# Altium schematic sheet CANBUS_Pendant.SchDoc: RP2040 CNC
size B; Author: AM; CompanyName: Expatria Technologies; DrawnBy: A.Marles; Engineer: AM; Organization: Expatria Technolgoies; Address1: PO Box 2084; Address3: Merritt, BC V1K 1B8; Address4: Canada; DocumentNumber: 24; SheetNumber: 24; SheetTotal: 27
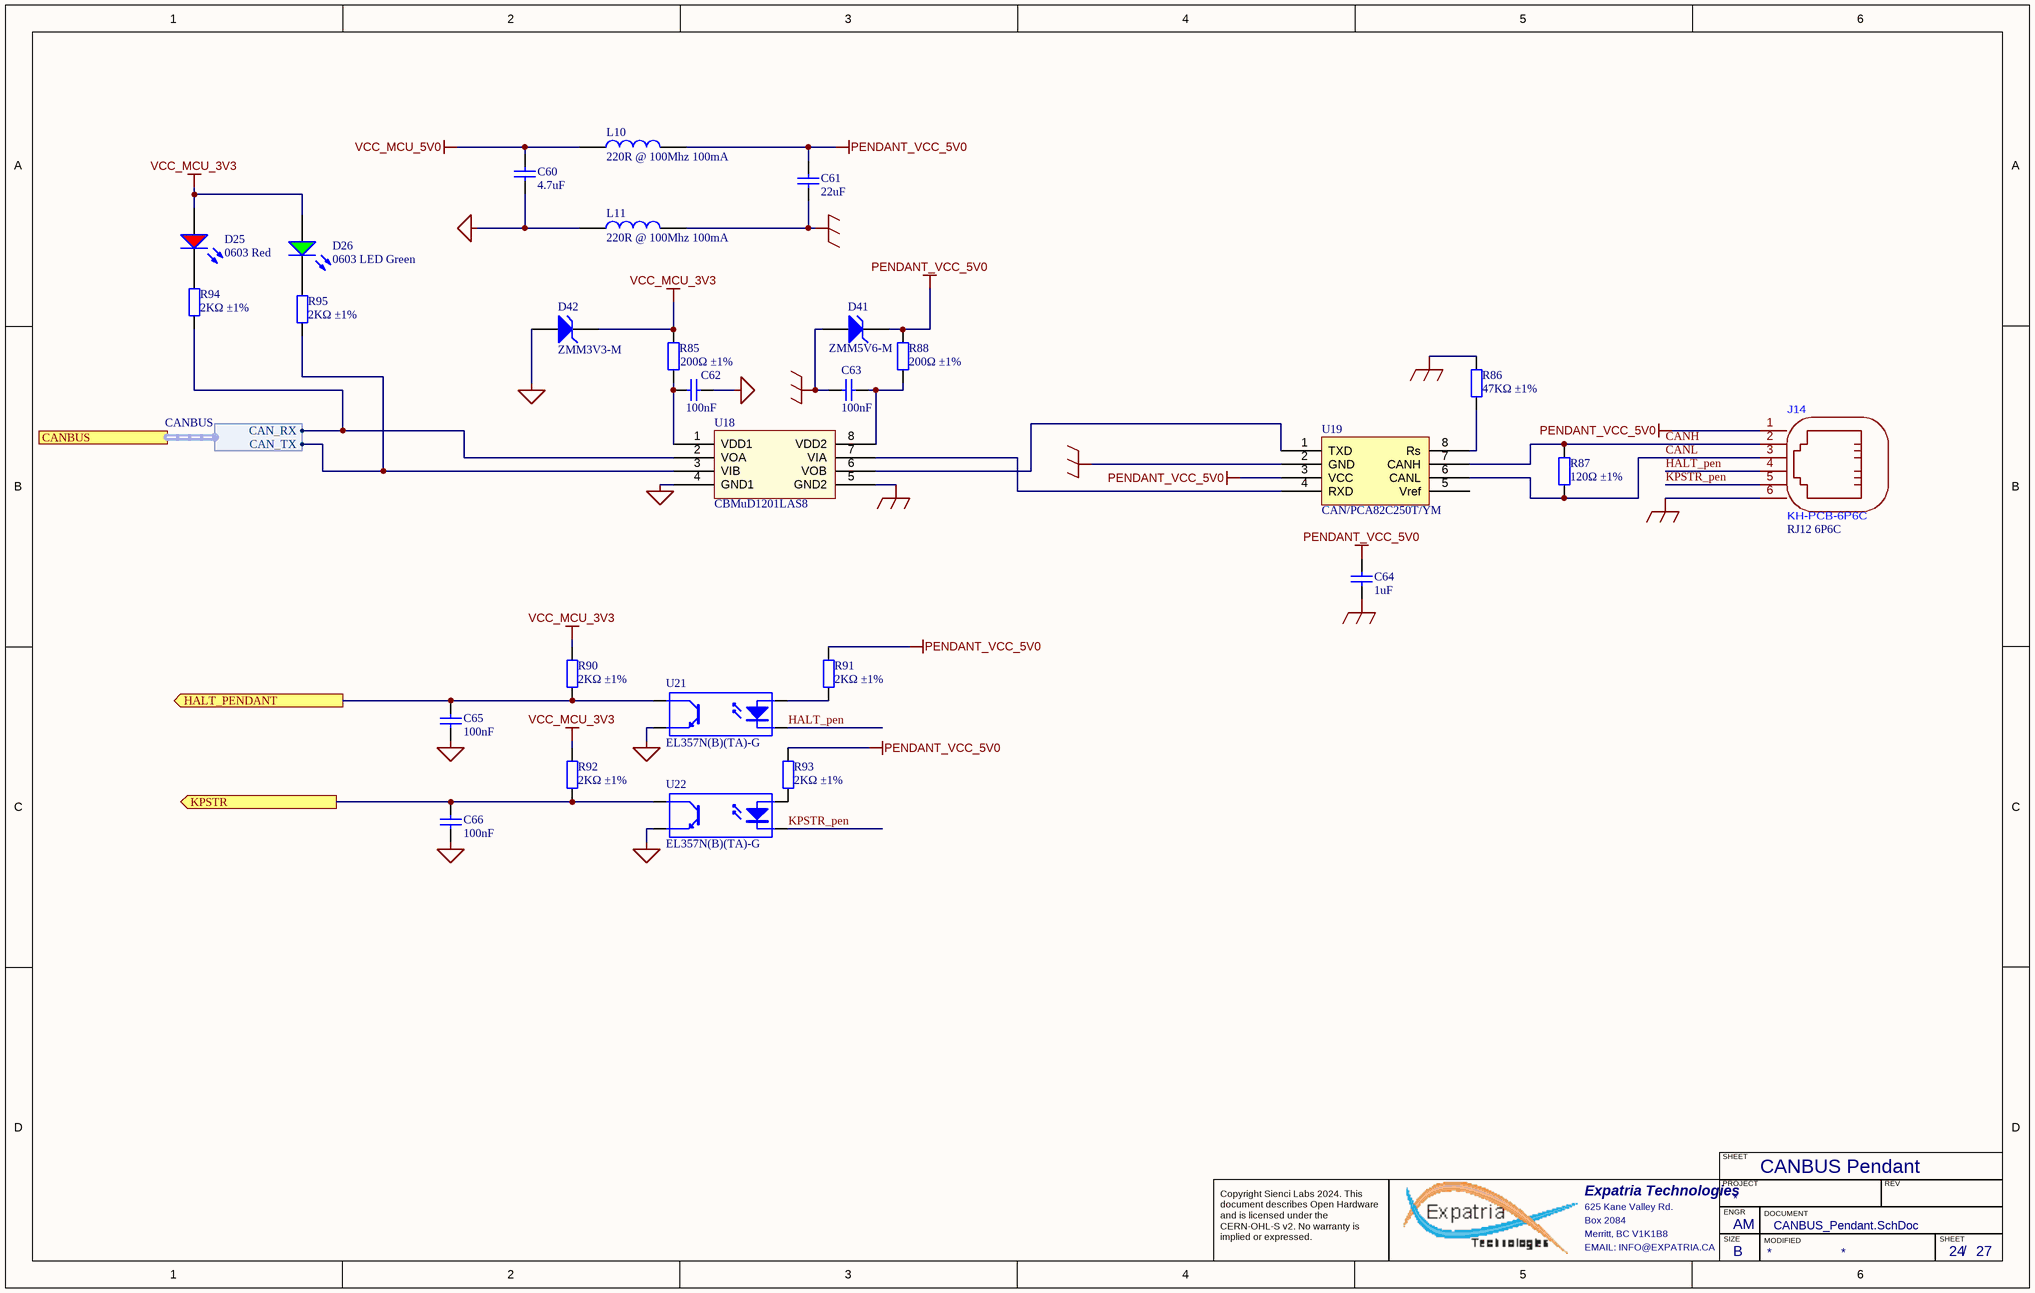
[diagram p0: CANBUS_Pendant.SchDoc]

## Parts
C60  4.7uF  [0805_C]
C61  22uF  [0805_C]
C62  100nF  [0402_C]
C63  100nF  [0402_C]
C64  1uF  [0603_C]
C65  100nF  [0603_C]
C66  100nF  [0603_C]
D25  0603 Red  [0603_LED_S1]
D26  0603 LED Green  [0603_LED_S1 - GREEN]
D41  ZMM5V6-M  [LL-34]
D42  ZMM3V3-M  [LL-34]
J14  KH-PCB-6P6C  value RJ12 6P6C  [RJ11-TH_DS1133-S60BPX]
L10  220R @ 100Mhz 100mA  [0402_L]
L11  220R @ 100Mhz 100mA  [0402_L]
R85  200Ω ±1%  [0402_R]
R86  47KΩ ±1%  [0402_R]
R87  120Ω ±1%  [0805_R]
R88  200Ω ±1%  [0402_R]
R90  2KΩ ±1%  [0402_R]
R91  2KΩ ±1%  [0402_R]
R92  2KΩ ±1%  [0402_R]
R93  2KΩ ±1%  [0402_R]
R94  2KΩ ±1%  [0402_R]
R95  2KΩ ±1%  [0402_R]
U18  CBMuD1201LAS8  [SOIC-8_150mil]
U19  CAN/PCA82C250T/YM  [SOIC-8_150mil]
U21  EL357N(B)(TA)-G  [SOP-4_P2.54]
U22  EL357N(B)(TA)-G  [SOP-4_P2.54]

## Ports
CANBUS (harness CANBUS), HALT_PENDANT (out), KPSTR (out)

## Harnesses
CANBUS: CAN_TX, CAN_RX

## Nets
MCU_GND: C60.1 C62.2 C65.1 C66.1 D42.1(A) L11.1 U18.4(GND1) U21.3(E) U22.3(E)
PEND_GND: C61.1 C63.1 C64.1 D41.1(A) J14.6(NC) L11.2 R86.2 U18.5(GND2) U19.2(GND)
PENDANT_VCC_5V0: C61.2 C64.2 D41.2(K) J14.1(MCLR) L10.2 R88.2 R91.2 R93.2 U19.3(VCC)
VCC_MCU_3V3: D25.A D26.A D42.2(K) R85.2 R90.2 R92.2
VCC_MCU_5V0: C60.2 L10.1
CANH: J14.2(VDD) R87.2 U19.7(CANH)
CANL: J14.3(VSS) R87.1 U19.6(CANL)
HALT_pen: J14.4(PGD) U21.2(K)
HALT_PENDANT: C65.2 R90.1 U21.4(C) ; port HALT_PENDANT
KPSTR: C66.2 R92.1 U22.4(C) ; port KPSTR
KPSTR_pen: J14.5(PGC) U22.2(K)
NetC62_1: C62.1 R85.1 U18.1(VDD1)
NetC63_2: C63.2 R88.1 U18.8(VDD2)
NetD25_K: D25.K R94.2
NetD26_K: D26.K R95.2
NetR86_1: R86.1 U19.8(Rs)
NetR91_1: R91.1 U21.1(A)
NetR93_1: R93.1 U22.1(A)
NetR94_1: R94.1 U18.2(VOA) ; port CANBUS.CAN_RX
NetR95_1: R95.1 U18.3(VIB) ; port CANBUS.CAN_TX
NetU18_6: U18.6(VOB) U19.1(TXD)
NetU18_7: U18.7(VIA) U19.4(RXD)

Not connected (* = marked no-connect by the designer): U19 5(Vref)

## Notes on the sheet
- CANBUS Pendant
- SHEET
- Expatria Technologies
- 625 Kane Valley Rd.
- Box 2084
- Merritt, BC V1K1B8
- PROJECT
- SIZE
- ENGR
- MODIFIED
- DOCUMENT
- REV
- Copyright Sienci Labs 2024. This document describes Open Hardware and is licensed under the CERN-OHL-S v2. No warranty is implied or expressed.
- EMAIL: INFO@EXPATRIA.CA
- B
- /

## Library data of the parts
C60 = 0805 4.7uF (475) 10% 25V: Chip capacitors; Manufacturer: Samsung Electro-Mechanics; Manufacturer Part Number: CL21A475KAQNNNE; Tolerance: 10%; Voltage: 25V; ComponentLink1Description: Supplier link; ComponentLink1URL: http://www.szlcsc.com/product/details_2131.html; Package: 0805; Supplier: LCSC; SuppliersPartNumber: C1779; Capacitance: 4.7uF
C61 = 0805 22uF (226) 20% 25V: 25V 22uF X5R ±20% 0805 Multilayer Ceramic Capacitors MLCC - SMD/SMT ROHS; Manufacturer: Samsung Electro-Mechanics; Manufacturer Part Number: CL21A226MAQNNNE; ComponentLink1Description: Supplier link; ComponentLink1URL: http://www.szlcsc.com/product/details_46786.html; Package: 0805; Supplier: LC; SuppliersPartNumber: C45783; Capacitance: 22uF; Tolerance: 20%; Voltage: 25V
C62 C63 = 0402 100nF (104) 10% 16V: 16V 100nF X7R ±10% 0402 Multilayer Ceramic Capacitors MLCC - SMD/SMT ROHS; Manufacturer: Samsung Electro-Mechanics; Manufacturer Part Number: CL05B104KO5NNNC; ComponentLink1Description: Supplier link; ComponentLink1URL: http://www.szlcsc.com/product/details_1877.html; Package: 0402; Supplier: LC; SuppliersPartNumber: C1525; Capacitance: 100nF; Tolerance: 10%; Voltage: 16V
C64 = 0603 1uF (105) 10% 50V: Chip capacitors; Manufacturer: Samsung Electro-Mechanics; Manufacturer Part Number: CL10A105KB8NNNC; Tolerance: 10%; Voltage: 50V; ComponentLink1Description: Supplier link; ComponentLink1URL: http://www.szlcsc.com/product/details_16531.html; Package: 0603; Supplier: LCSC; SuppliersPartNumber: C15849; Capacitance: 1uF
C65 C66 = 0603 100nF (104) 10% 50V: 50V 100nF X7R ±10% 0603 Multilayer Ceramic Capacitors MLCC - SMD/SMT ROHS; Manufacturer: YAGEO; Manufacturer Part Number: CC0603KRX7R9BB104; ComponentLink1Description: Supplier link; ComponentLink1URL: http://www.szlcsc.com/product/details_15331.html; Package: 0603; Supplier: LC; SuppliersPartNumber: C14663; Capacitance: 100nF; Tolerance: 10%; Voltage: 50V
D25 = KT-0603R: -40℃~+85℃ Red 0603 Light Emitting Diodes (LED) ROHS; Manufacturer: Hubei KENTO Elec; Package: 0603; Supplier: LC; SuppliersPartNumber: C2286; Color: Red; Manufacturer Part Number: KT-0603R; Value: 0603 Red
D26 = MHT192UGCT: 20mA -40℃~+85℃ 515nm~530nm Emerald 120° 60mW 0603 Light Emitting Diodes (LED) ROHS; Manufacturer: MEIHUA; Package: 0603; Supplier: LC; SuppliersPartNumber: C389519; Color: Green; Manufacturer Part Number: MHT192UGCT
D41 = LL-34 ZMM5V6-M: Single 500mW 5.2V~6V 5.6V LL-34 Zener Diodes ROHS; Manufacturer Part Number: ZMM5V6; Manufacturer: HXY MOSFET; Package: LL-34; Supplier: LC; SuppliersPartNumber: C5345993
D42 = LL-34 ZMM3V3-M: Single 3.1V~3.5V 500mW 3.3V LL-34 Zener Diodes ROHS; Manufacturer: ST(Semtech); ComponentLink1Description: 供应商链接; ComponentLink1URL: http://www.szlcsc.com/product/details_8541.html; Package: LL-34; Supplier: LC; SuppliersPartNumber: C8056; Manufacturer Part Number: ZMM3V3-M
J14 = KH-PCB-6P6C: RJ45 RJReceptacle No 1 Shrouded Without LED -45℃~+85℃ Plugin Ethernet Connectors/Modular Connectors (RJ45 RJ11) ROHS; Manufacturer: Shenzhen Kinghelm Elec; Manufacturer Part Number: KH-PCB-6P6C; SuppliersPartNumber: C2683354; Supplier: LCSC
L10 L11 = 0402 220R@100Mhz 0.1A: 700mΩ ±25% 220Ω@100MHz 0402 Ferrite Beads ROHS; Manufacturer Part Number: CBG100505U221T; Manufacturer: FH (Guangdong Fenghua Advanced Tech); Package: 0402; Supplier: LC; SuppliersPartNumber: C92617
R85 R88 = 0402 200R (2000) 1%: Chip resistor; Manufacturer: Uniroyal Elec; Manufacturer Part Number: 0402WGF2000TCE; Power: 1/16W; ComponentLink1Description: Supplier link; ComponentLink1URL: http://www.szlcsc.com/product/details_25830.html; Package: 0402; Supplier: LC; SuppliersPartNumber: C25087; Resistance: 200Ω; Tolerance: 1%
R86 = 0402 47K (4702) 1%: Chip resistor; Manufacturer: Uniroyal Elec; Manufacturer Part Number: 0402WGF4702TCE; Power: 1/16W; ComponentLink1Description: Supplier link; ComponentLink1URL: http://www.szlcsc.com/product/details_26535.html; Package: 0402; Supplier: LCSC; SuppliersPartNumber: C25792; Resistance: 47KΩ; Tolerance: 1%
R87 = 0805 120R (1200) 1%: Chip resistor; Manufacturer: Uniroyal Elec; Manufacturer Part Number: 0805W8F1200T5E; Power: 1/8W; ComponentLink1Description: Supplier link; ComponentLink1URL: http://www.szlcsc.com/product/details_18125.html; Package: 0805; Supplier: LCSC; SuppliersPartNumber: C17437; Tolerance: 1%
R90-R95 = 0402 2K (2001) 1%: Chip resistor; Manufacturer: Uniroyal Elec; Manufacturer Part Number: 0402WGF2001TCE; Power: 1/16W; ComponentLink1Description: Supplier link; ComponentLink1URL: http://www.szlcsc.com/product/details_4516.html; Package: 0402; Supplier: LC; SuppliersPartNumber: C4109; Resistance: 2KΩ; Tolerance: 1%
U18 = CBMuD1201LAS8: Dual Channel Isolator; Manufacturer: Corebai Microelectronics; Package: SOIC-8_150mil; Supplier: LC; SuppliersPartNumber: C476472; ComponentLink1Description: 供应商链接; ComponentLink1URL: http://www.szlcsc.com/product/details_10199.html; Manufacturer Part Number: CBMuD1201LAS8
U19 = CAN/PCA82C250T/YM_[C7439]: CAN; Manufacturer Part Number: PCA82C250T/YM,118; Manufacturer: NXP Semicon; ComponentLink1Description: 供应商链接; ComponentLink1URL: http://www.szlcsc.com/product/details_7916.html; Package: SOIC-8_150mil; Supplier: LCSC; SuppliersPartNumber: C7439
U21 U22 = EL357N(B)(TA)-G_[C6649]: Optocoupler SOP-4, EL357N(B)(TA)-G, Everlight Electronics; Package: SOP-4_P2.54; Supplier: LC; SuppliersPartNumber: C6649; Manufacturer: Everlight; Manufacturer Part Number: EL357N(B)(TA)-G